# Altium schematic sheet smartBattery.SchDoc
size A4; SheetNumber: 1; SheetTotal: 1
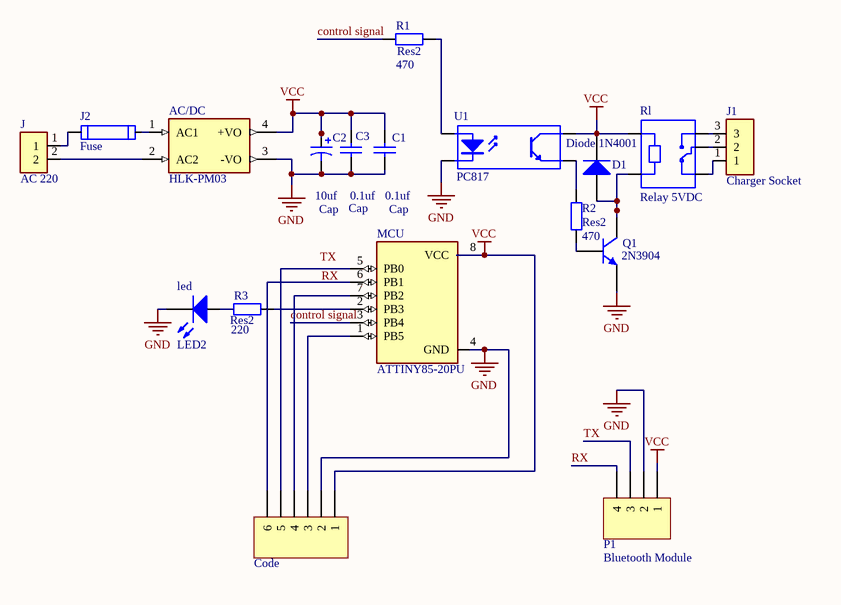
[diagram p0: smartBattery.SchDoc]

## Parts
AC/DC  HLK-PM03  [CONV_HLK-PM03]
C1  Cap  value 0.1uf  [RAD-0.3]
C2  Cap  value 10uf  [RB7.6-15]
C3  Cap  value 0.1uf  [RAD-0.3]
Code  (no value)  [HDR1X6]
D1  Diode 1N4001  [DO-41]
J  AC 220  [CONN_282834-2]
J1  Charger Socket  [TE_282834-3]
J2  Fuse  [696310001002]
led  LED2  [3.2X1.6X1.1]
MCU  ATTINY85-20PU  [DIP762W46P254L927H533Q8B]
P1  Bluetooth Module  [HDR1X4]
Q1  2N3904  [TO-92A]
R1  Res2  value 470  [AXIAL-0.4]
R2  Res2  value 470  [AXIAL-0.4]
R3  Res2  value 220  [AXIAL-0.4]
Rl  Relay 5VDC  [RELAY_SRD-05VDC-SL-C]
U1  PC817  [DIP-4]

## Nets
GND: AC/DC.3(-VO) C1.1 C2.2 C3.1 Code.2 led.2(K) MCU.4(GND) P1.2 Q1.1(E) U1.2(K)
VCC: AC/DC.4(+VO) C1.2 C2.1 C3.2 Code.1 D1.2(K) MCU.8(VCC) P1.1 Rl.A1 U1.4(C)
control signal: MCU.3(PB4) R1.1
RX: P1.4
TX: P1.3
NetAC/DC_1: AC/DC.1(AC1) J2.2
NetAC/DC_2: AC/DC.2(AC2) J.2
NetCode_3: Code.3 MCU.1(PB5)
NetCode_4: Code.4 MCU.7(PB2)
NetCode_5: Code.5 MCU.5(PB0)
NetCode_6: Code.6 MCU.6(PB1)
NetD1_1: D1.1(A) Q1.3(C) Rl.A2
NetJ1_1: J1.1 Rl.NC
NetJ1_2: J1.2 Rl.COM
NetJ1_3: J1.3 Rl.NO
NetJ_1: J.1 J2.1
Netled_1: led.1(A) R3.1
NetMCU_2: MCU.2(PB3) R3.2
NetQ1_2: Q1.2(B) R2.1
NetR1_2: R1.2 U1.1(A)
NetR2_2: R2.2 U1.3(E)

## Notes on the sheet
- Labels drawn without touching a wire or pin: RX, TX

## Library data of the parts
AC/DC = HLK-PM03: AC DC 3W power module; MF: Hi-link; Package: Package; Availability: Unavailable; SnapEDA_Link: https://www.snapeda.com/parts/HLK-PM03/Hi-link/view-part/3215695/?ref=snap; MP: HLK-PM03; Price: None; Value: *
C1 C3 = Cap: Capacitor; Published: 8-Jun-2000; LatestRevisionDate: 17-Jul-2002; LatestRevisionNote: Re-released for DXP Platform.; PackageReference: RAD-0.3; Publisher: Altium Limited; PackageDescription: Radial Cap, Thru-Hole; 2 Leads; 0.3 in Pin Spacing
C2 = Cap Pol1: Polarized Capacitor (Radial); Published: 8-Jun-2000; LatestRevisionDate: 17-Jul-2002; LatestRevisionNote: Re-released for DXP Platform.; PackageReference: RB7.6-15; Publisher: Altium Limited; PackageDescription: Polarized Capacitor (Radial); 2 Leads
Code = Header 6: Header, 6-Pin; LatestRevisionDate: 17-Jul-2002; LatestRevisionNote: Re-released for DXP Platform.; Publisher: Altium Limited
D1 = Diode 1N4001: 1 Amp General Purpose Rectifier; Published: 8-Jun-2000; LatestRevisionDate: 17-Jul-2002; LatestRevisionNote: Re-released for DXP Platform.; DatasheetVersion: 1998; PackageVersion: Aug-1999; PackageReference: DO-41; Publisher: Altium Limited; PackageDescription: Diode, Axial; Body 5.2 x 2.7 mm (LxDia. max), Lead Dia. 0.86 mm (max); Code_JEDEC: DO-204-AL; ComponentLink1Description: Manufacturer Link; ComponentLink1URL: http://www.fairchildsemi.com/; ComponentLink2Description: Datasheet; ComponentLink2URL: http://www.fairchildsemi.com/ds/1N%2F1N4001.pdf
J = 282834-2: Wire-To-Board Terminal Block, 2, 150 V, 10 A, 30 Awg, 16 Awg, 1.4 Mm; MF: TE Connectivity; Centerline_Pitch: 2.54 mm[.1 in]; Number_of_Positions: 2; EU_RoHS_Compliance: Compliant with Exemptions; SnapEDA_Link: https://www.snapeda.com/parts/282834-2/TE%20Connectivity%20AMP%20Connectors/view-part/431057/?ref=snap; Price: None; Value: *; MP: 282834-2; TE_purchase_URL: https://www.te.com/usa-en/product-282834-2.html?te_bu=Cor&te_type=disp&te_campaign=seda_glo_cor-seda-global-disp-prtnr-fy19-seda-model-bom-cta_sma-317_1&elqCampaignId=32493; Availability: Unavailable; Package: None
J1 = 282834-3: 3 Position Wire to Board Terminal Block Horizontal with Board 0.100 (2.54mm); MF: TE Connectivity; EU_RoHS_Compliance: Compliant with Exemptions; SnapEDA_Link: https://www.snapeda.com/parts/282834-3/TE%20Connectivity%20AMP%20Connectors/view-part/398089/?ref=snap; Price: None; Check_prices: https://www.snapeda.com/parts/282834-3/TE%20Connectivity%20AMP%20Connectors/view-part/398089/?ref=eda; Purchase-URL: https://pricing.snapeda.com/search/part/282834-3/?ref=eda; Package: None; MP: 282834-3; Value: *; Availability: Good
J2 = 696310001002: Fuse Holder 20A 250V 1 Circuit Cartridge Through Hole; MF: Wurth Electronics; Package: None; SnapEDA_Link: https://www.snapeda.com/parts/696310001002/Wurth%20Electronics%20Inc./view-part/1196556/?ref=snap; Availability: Warning; MP: 696310001002; Price: None; Purchase-URL: https://pricing.snapeda.com/search/part/696310001002/?ref=eda; Check_prices: https://www.snapeda.com/parts/696310001002/Wurth%20Electronics%20Inc./view-part/1196556/?ref=eda; Value: *
led = LED2: Typical RED, GREEN, YELLOW, AMBER GaAs LED; Published: 8-Jun-2000; LatestRevisionDate: 17-Jul-2002; LatestRevisionNote: Re-released for DXP Platform.; PackageVersion: Feb-2002; PackageReference: 3.2X1.6X1.1; Publisher: Altium Limited; PackageDescription: SM LED; 2 Flat Leads
MCU = ATTINY85-20PU: AVR AVRÂ® ATtiny, Functional Safety (FuSa) Microcontroller IC 8-Bit 20MHz 8KB (4K x 16) FLASH 8-PDIP; MF: Microchip; MP: ATTINY85-20PU; Price: None; Purchase-URL: https://pricing.snapeda.com/search/part/ATTINY85-20PU/?ref=eda; Package: DIP-8 Atmel; Check_prices: https://www.snapeda.com/parts/ATTINY85-20PU/Microchip/view-part/42827/?ref=eda; Value: *; Availability: Good; SnapEDA_Link: https://www.snapeda.com/parts/ATTINY85-20PU/Microchip/view-part/42827/?ref=snap
P1 = Header 4: Header, 4-Pin; LatestRevisionDate: 17-Jul-2002; LatestRevisionNote: Re-released for DXP Platform.; Publisher: Altium Limited
Q1 = 2N3904: NPN General Purpose Amplifier; Published: 8-Jun-2000; LatestRevisionDate: 15-Jan-2003; LatestRevisionNote: PCB Footprint 'BCY-W3/D4.7' replaced; DatasheetVersion: 1997; PackageVersion: Sep-1998; PackageReference: TO-92A; Publisher: Altium Limited; PackageDescription: TO, Flat Index; 3 In-Line, Axial Leads; Body Dia. 4.5mm; Leads 0.51 x 0.48 mm (max); ComponentLink1Description: Manufacturer Link; ComponentLink1URL: http://www.fairchildsemi.com/; ComponentLink2Description: Datasheet; ComponentLink2URL: http://www.fairchildsemi.com/ds/2N%2F2N3904.pdf
R1-R3 = Res2: Resistor; Published: 8-Jun-2000; LatestRevisionDate: 17-Jul-2002; LatestRevisionNote: Re-released for DXP Platform.; PackageReference: AXIAL-0.4; Publisher: Altium Limited; PackageDescription: Axial Device, Thru-Hole; 2 Leads; 0.4 in Pin Spacing
Rl = SRD-05VDC-SL-C: 5V Trigger Relay Module For Arduino And Raspberry Pi 5V Trigger Relay Module For Arduino And Raspberry Pi; MF: Songle Relay; Package: None; Availability: Unavailable; Value: *; MP: SRD-05VDC-SL-C; SnapEDA_Link: https://www.snapeda.com/parts/SRD-05VDC-SL-C/Songle%20Relay/view-part/1029484/?ref=snap; Price: None
U1 = Optoisolator1: 4-Pin Phototransistor Optocoupler; Published: 24-Mar-1999; LatestRevisionDate: 04-Mar-2005; LatestRevisionNote: Sch pins 3 & 4 Swapped.; DatasheetVersion: Nov-2003; PackageReference: DIP-4; Publisher: Altium Limited